# Altium schematic sheet rs422.SchDoc
size A
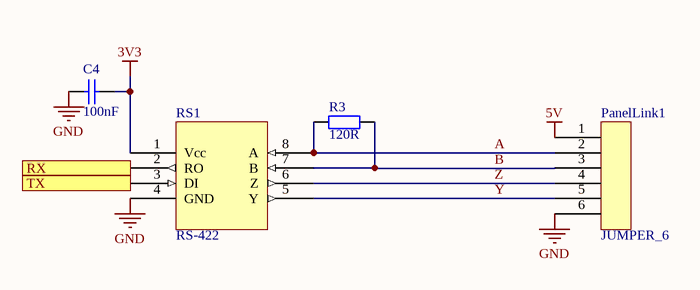
[diagram p0: rs422.SchDoc]

## Parts
C4  100nF  [FP_0805_CAP_085]
PanelLink1  JUMPER_6  [JUMPER_6]
R3  120R  [FP_0805_RES]
RS1  RS-422  [NSOIC-8]

## Ports
RX (out), TX (in)

## Nets
3V3: C4.1 RS1.1(Vcc)
5V: PanelLink1.1
GND: C4.2 PanelLink1.6 RS1.4(GND)
A: PanelLink1.2 R3.1 RS1.8(A)
B: PanelLink1.3 R3.2 RS1.7(B)
RX: RS1.2(RO) ; port RX
TX: RS1.3(DI) ; port TX
Y: PanelLink1.5 RS1.5(Y)
Z: PanelLink1.4 RS1.6(Z)

## Library data of the parts
C4 = CAP 100nF: Capacitor; Tolerance: +80%/-20%; Voltage: 25V; Reference: 1759167; Name: SMD Multilayer Ceramic Capacitor, 0805; Supplier: Farnell; Value: 100nF
R3 = RES 120R: Resistor; Tolerance: 5%; Power: 125mW; Name: YAGEO (PHYCOMP)  RC0805JR-07120RL  SMD Chip Resistor, Thick Film, 120 ohm; Reference: 9233890; Supplier: Farnell; Value: 120R
RS1 = ISL83071: RS-422 transceiver 3V3